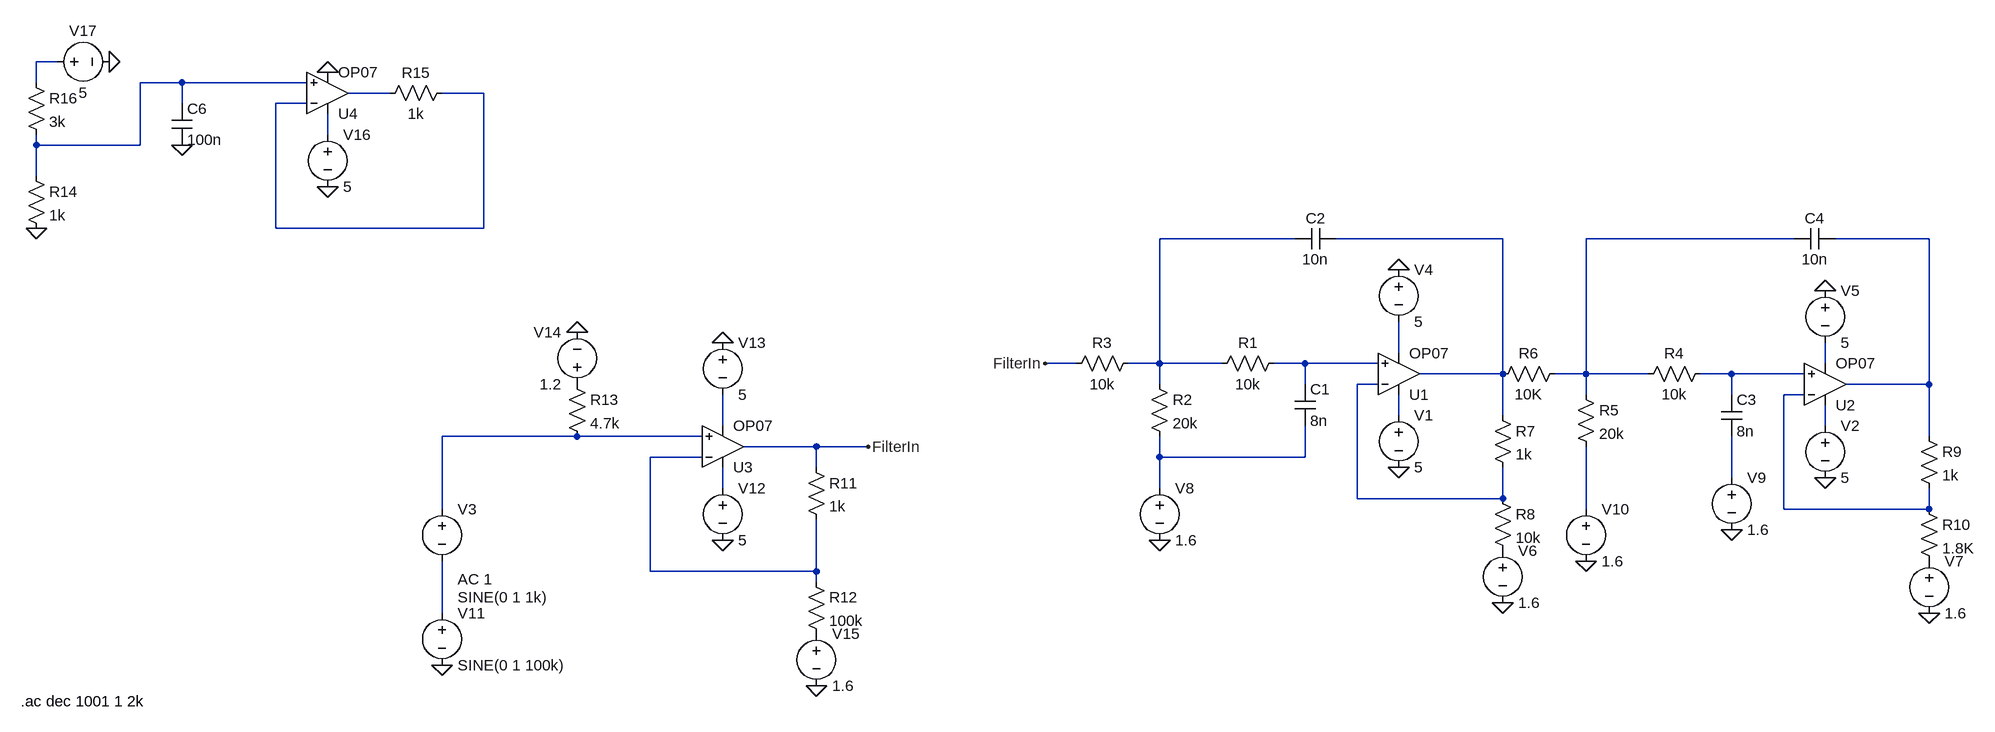
[diagram p0: schematic 4_th_Butterwoth_lowpass_filter.asc]
4_th_Butterwoth_lowpass_filter.asc, the LTspice schematic file:
Version 4
SHEET 1 1324 1072
WIRE -1632 -416 -1664 -416
WIRE -1664 -384 -1664 -416
WIRE -1440 -384 -1504 -384
WIRE -1248 -384 -1440 -384
WIRE -1120 -368 -1184 -368
WIRE -976 -368 -1040 -368
WIRE -1440 -352 -1440 -384
WIRE -1248 -352 -1296 -352
WIRE -1216 -304 -1216 -336
WIRE -1664 -288 -1664 -304
WIRE -1504 -288 -1504 -384
WIRE -1504 -288 -1664 -288
WIRE -1664 -240 -1664 -288
WIRE -1296 -160 -1296 -352
WIRE -976 -160 -976 -368
WIRE -976 -160 -1296 -160
WIRE 272 -144 64 -144
WIRE 592 -144 336 -144
WIRE 1040 -144 720 -144
WIRE 1248 -144 1104 -144
WIRE 432 32 432 -16
WIRE -64 48 -112 48
WIRE 64 48 64 -144
WIRE 64 48 16 48
WIRE 160 48 64 48
WIRE 288 48 240 48
WIRE 400 48 288 48
WIRE 1088 48 1088 16
WIRE 592 64 592 -144
WIRE 592 64 464 64
WIRE 720 64 720 -144
WIRE 720 64 672 64
WIRE 816 64 720 64
WIRE 944 64 896 64
WIRE 1056 64 944 64
WIRE 64 80 64 48
WIRE 288 80 288 48
WIRE 400 80 368 80
WIRE 1248 80 1248 -144
WIRE 1248 80 1120 80
WIRE 720 96 720 64
WIRE 944 96 944 64
WIRE 1056 96 1024 96
WIRE 432 128 432 96
WIRE 592 128 592 64
WIRE -608 144 -608 96
WIRE 1088 144 1088 112
WIRE -832 160 -1040 160
WIRE -640 160 -832 160
WIRE 1248 160 1248 80
WIRE -464 176 -576 176
WIRE -384 176 -464 176
WIRE -640 192 -720 192
WIRE 64 192 64 160
WIRE 288 192 288 144
WIRE 288 192 64 192
WIRE -464 208 -464 176
WIRE 944 224 944 160
WIRE -608 240 -608 208
WIRE 64 240 64 192
WIRE 368 256 368 80
WIRE 592 256 592 208
WIRE 592 256 368 256
WIRE -1040 272 -1040 160
WIRE 720 272 720 176
WIRE 1024 272 1024 96
WIRE 1248 272 1248 240
WIRE 1248 272 1024 272
WIRE -720 368 -720 192
WIRE -464 368 -464 288
WIRE -464 368 -720 368
WIRE -464 384 -464 368
WIRE -1040 432 -1040 352
FLAG 432 208 0
FLAG 1088 224 0
FLAG 432 -96 0
FLAG 1088 -64 0
FLAG 64 320 0
FLAG 720 352 0
FLAG 944 304 0
FLAG 1248 432 0
FLAG 592 416 0
FLAG -1040 512 0
FLAG -608 320 0
FLAG -608 16 0
FLAG -464 544 0
FLAG -1216 -400 0
FLAG -1216 -224 0
FLAG -1440 -288 0
FLAG -1664 -160 0
FLAG -1552 -416 0
FLAG -832 0 0
FLAG -112 48 FilterIn
FLAG -384 176 FilterIn
SYMBOL OpAmps\\OP07 432 128 M180
SYMATTR InstName U1
SYMBOL voltage 432 112 R0
WINDOW 123 0 0 Left 0
WINDOW 39 0 0 Left 0
SYMATTR InstName V1
SYMATTR Value 5
SYMBOL cap 272 80 R0
SYMATTR InstName C1
SYMATTR Value 8n
SYMBOL res 256 32 R90
WINDOW 0 0 56 VBottom 2
WINDOW 3 32 56 VTop 2
SYMATTR InstName R1
SYMATTR Value 10k
SYMBOL res 48 64 R0
SYMATTR InstName R2
SYMATTR Value 20k
SYMBOL res 32 32 R90
WINDOW 0 0 56 VBottom 2
WINDOW 3 32 56 VTop 2
SYMATTR InstName R3
SYMATTR Value 10k
SYMBOL cap 336 -160 R90
WINDOW 0 0 32 VBottom 2
WINDOW 3 32 32 VTop 2
SYMATTR InstName C2
SYMATTR Value 10n
SYMBOL OpAmps\\OP07 1088 144 M180
SYMATTR InstName U2
SYMBOL voltage 1088 128 R0
WINDOW 123 0 0 Left 0
WINDOW 39 0 0 Left 0
SYMATTR InstName V2
SYMATTR Value 5
SYMBOL cap 928 96 R0
SYMATTR InstName C3
SYMATTR Value 8n
SYMBOL res 912 48 R90
WINDOW 0 0 56 VBottom 2
WINDOW 3 32 56 VTop 2
SYMATTR InstName R4
SYMATTR Value 10k
SYMBOL res 704 80 R0
SYMATTR InstName R5
SYMATTR Value 20k
SYMBOL res 688 48 R90
WINDOW 0 0 56 VBottom 2
WINDOW 3 32 56 VTop 2
SYMATTR InstName R6
SYMATTR Value 10K
SYMBOL cap 1104 -160 R90
WINDOW 0 0 32 VBottom 2
WINDOW 3 32 32 VTop 2
SYMATTR InstName C4
SYMATTR Value 10n
SYMBOL voltage -1040 256 R0
WINDOW 3 24 152 Left 2
WINDOW 123 24 124 Left 2
WINDOW 39 0 0 Left 0
SYMATTR Value SINE(0 1 1k)
SYMATTR Value2 AC 1
SYMATTR InstName V3
SYMBOL res 576 112 R0
SYMATTR InstName R7
SYMATTR Value 1k
SYMBOL res 576 240 R0
SYMATTR InstName R8
SYMATTR Value 10k
SYMBOL res 1232 144 R0
SYMATTR InstName R9
SYMATTR Value 1k
SYMBOL res 1232 256 R0
SYMATTR InstName R10
SYMATTR Value 1.8K
SYMBOL voltage 432 -112 R0
WINDOW 123 0 0 Left 0
WINDOW 39 0 0 Left 0
SYMATTR InstName V4
SYMATTR Value 5
SYMBOL voltage 1088 -80 R0
WINDOW 123 0 0 Left 0
WINDOW 39 0 0 Left 0
SYMATTR InstName V5
SYMATTR Value 5
SYMBOL voltage 592 320 R0
WINDOW 123 0 0 Left 0
WINDOW 39 0 0 Left 0
SYMATTR InstName V6
SYMATTR Value 1.6
SYMBOL voltage 1248 336 R0
WINDOW 123 0 0 Left 0
WINDOW 39 0 0 Left 0
SYMATTR InstName V7
SYMATTR Value 1.6
SYMBOL voltage 64 224 R0
WINDOW 123 0 0 Left 0
WINDOW 39 0 0 Left 0
SYMATTR InstName V8
SYMATTR Value 1.6
SYMBOL voltage 944 208 R0
WINDOW 123 0 0 Left 0
WINDOW 39 0 0 Left 0
SYMATTR InstName V9
SYMATTR Value 1.6
SYMBOL voltage 720 256 R0
WINDOW 123 0 0 Left 0
WINDOW 39 0 0 Left 0
SYMATTR InstName V10
SYMATTR Value 1.6
SYMBOL voltage -1040 416 R0
WINDOW 123 0 0 Left 0
WINDOW 39 0 0 Left 0
SYMATTR InstName V11
SYMATTR Value SINE(0 1 100k)
SYMBOL OpAmps\\OP07 -608 240 M180
SYMATTR InstName U3
SYMBOL voltage -608 224 R0
WINDOW 123 0 0 Left 0
WINDOW 39 0 0 Left 0
SYMATTR InstName V12
SYMATTR Value 5
SYMBOL voltage -608 0 R0
WINDOW 123 0 0 Left 0
WINDOW 39 0 0 Left 0
SYMATTR InstName V13
SYMATTR Value 5
SYMBOL res -480 192 R0
SYMATTR InstName R11
SYMATTR Value 1k
SYMBOL res -480 368 R0
SYMATTR InstName R12
SYMATTR Value 100k
SYMBOL voltage -464 448 R0
WINDOW 123 0 0 Left 0
WINDOW 39 0 0 Left 0
SYMATTR InstName V15
SYMATTR Value 1.6
SYMBOL OpAmps\\OP07 -1216 -304 M180
SYMATTR InstName U4
SYMBOL cap -1456 -352 R0
SYMATTR InstName C6
SYMATTR Value 100n
SYMBOL res -1024 -384 R90
WINDOW 0 0 56 VBottom 2
WINDOW 3 32 56 VTop 2
SYMATTR InstName R15
SYMATTR Value 1k
SYMBOL voltage -1216 -320 R0
WINDOW 123 0 0 Left 0
WINDOW 39 0 0 Left 0
SYMATTR InstName V16
SYMATTR Value 5
SYMBOL res -1680 -256 R0
SYMATTR InstName R14
SYMATTR Value 1k
SYMBOL res -1680 -400 R0
SYMATTR InstName R16
SYMATTR Value 3k
SYMBOL voltage -1648 -416 R270
WINDOW 0 32 56 VTop 2
WINDOW 3 -32 56 VBottom 2
WINDOW 123 0 0 Left 0
WINDOW 39 0 0 Left 0
SYMATTR InstName V17
SYMATTR Value 5
SYMBOL res -848 64 R0
SYMATTR InstName R13
SYMATTR Value 4.7k
SYMBOL voltage -832 96 R180
WINDOW 0 24 96 Left 2
WINDOW 3 24 16 Left 2
WINDOW 123 0 0 Left 0
WINDOW 39 0 0 Left 0
SYMATTR InstName V14
SYMATTR Value 1.2
TEXT -1688 568 Left 2 !.ac dec 1001 1 2k

The netlist it stands for:
* 4_th_Butterwoth_lowpass_filter.asc
XU1 N011 N014 N016 N010 N007 LT1001  ; OP07, pins In+ In- V+ V- OUT
V1 N016 0 5
C1 N011 N021 8n
R1 N011 N006 10k
R2 N006 N021 20k
R3 N006 FilterIn 10k
C2 N007 N006 10n
XU2 N013 N015 N018 N012 N009 LT1001  ; OP07, pins In+ In- V+ V- OUT
V2 N018 0 5
C3 N013 N022 8n
R4 N013 N008 10k
R5 N008 N024 20k
R6 N008 N007 10K
C4 N009 N008 10n
V3 N019 N025 SINE(0 1 1k) AC 1
R7 N007 N014 1k
R8 N014 P001 10k
R9 N009 N015 1k
R10 N015 P002 1.8K
V4 0 N010 5
V5 0 N012 5
V6 P001 0 1.6
V7 P002 0 1.6
V8 N021 0 1.6
V9 N022 0 1.6
V10 N024 0 1.6
V11 N025 0 SINE(0 1 100k)
XU3 N019 N020 N023 N017 FilterIn LT1001  ; OP07, pins In+ In- V+ V- OUT
V12 N023 0 5
V13 0 N017 5
R11 FilterIn N020 1k
R12 N020 P003 100k
V15 P003 0 1.6
XU4 N002 N004 N005 0 N003 LT1001  ; OP07, pins In+ In- V+ V- OUT
C6 N002 0 100n
R15 N004 N003 1k
V16 N005 0 5
R14 N002 0 1k
R16 N001 N002 3k
V17 N001 0 5
R13 P004 N019 4.7k
V14 P004 0 1.2
.ac dec 1001 1 2k
.lib LTC.lib
.backanno
.end